# EAGLE design jtag-swd (EAGLE 5.07)
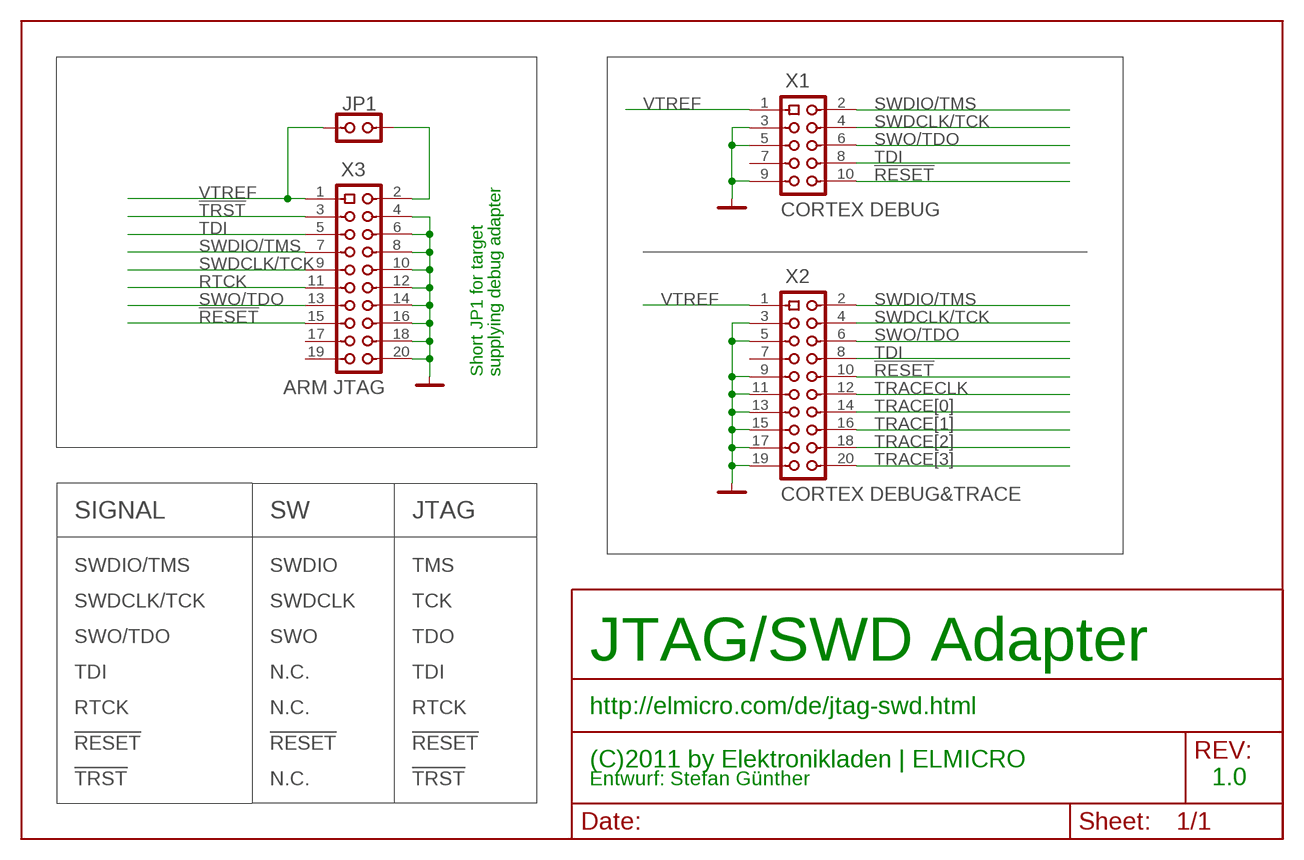
[diagram p0: schematic, sheet 1]

## Parts
JP1  JP2  [JP2]
X1  CORTEX DEBUG  PF2X5SMD1.27MM  [PF2X5SMD50MIL]
X2  CORTEX DEBUG&TRACE  PF2X101,27MMSMDPOS  [PF2X10SMD50MIL_POS]
X3  ARM JTAG  PF2X10  [PF2X10]

## Nets
!RESET: X1.10 X2.10 X3.15
!TRST: X3.3
GND: X1.3 X1.5 X1.9 X2.3 X2.5 X2.9 X2.11 X2.13 X2.15 X2.17 X2.19 X3.4 X3.6 X3.8 X3.10 X3.12 X3.14 X3.16 X3.18 X3.20
N$1: JP1.2 X3.2
RTCK: X3.11
SWDCLK/TCK: X1.4 X2.4 X3.9
SWDIO/TMS: X1.2 X2.2 X3.7
SWO/TDO: X1.6 X2.6 X3.13
TDI: X1.8 X2.8 X3.5
TRACE[0]: X2.14
TRACE[1]: X2.16
TRACE[2]: X2.18
TRACE[3]: X2.20
TRACECLK: X2.12
VTREF: JP1.1 X1.1 X2.1 X3.1
Unconnected: X1.7 X2.7 X3.17 X3.19

## Notes on the sheet
- Short JP1 for target | supplying debug adapter
- SIGNAL | SW | JTAG
- SWDIO/TMS | SWDIO | TMS
- SWDCLK/TCK | SWDCLK | TCK
- SWO/TDO | SWO | TDO
- JTAG/SWD Adapter
- TDI | N.C. | TDI
- RTCK | N.C. | RTCK | http://elmicro.com/de/jtag-swd.html
- !RESET | !RESET | !RESET
- (C)2011 by Elektronikladen | ELMICRO
- !TRST | N.C. | !TRST | Entwurf: Stefan Günther | 1.0

## Library data of the parts
JP1 = A_CONN:JP2
X1 = A_CONN:PF2X5
X2 X3 = A_CONN:PF2X10

## Board
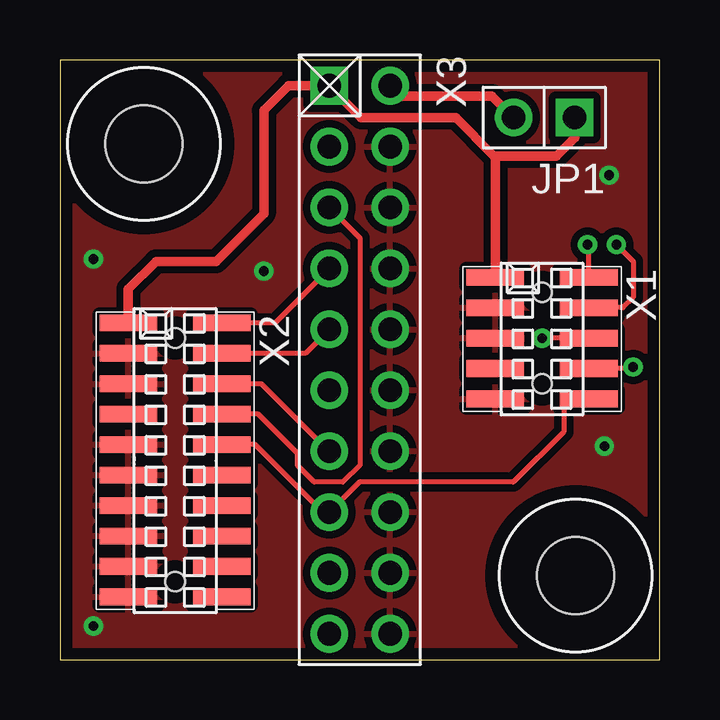
[diagram p1: board, top side]
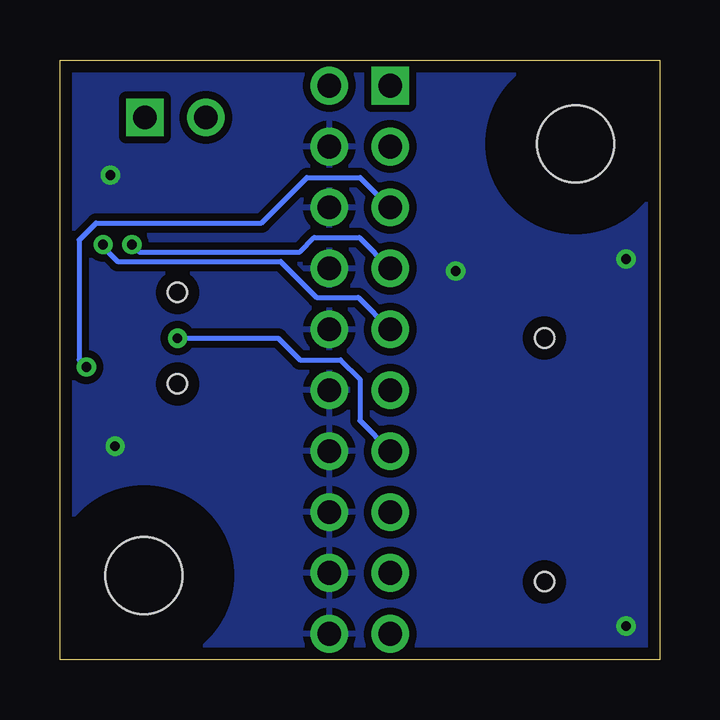
[diagram p2: board, bottom side, seen from below]

Size 25 x 25 mm. Coordinates in mm from the lower left corner, seen from the top.
Outline: 0,25 0,0 25,0 25,25 0,25
Copper layers (1*2*3*16): Top 0.035mm / dielectric 0.5mm / Route2 0.035mm / dielectric 0.26mm / Route3 0.035mm / dielectric 0.5mm / Bottom 0.035mm
Design rules "pcbpool_standard_2010-09-08": minimum track width 0.15mm, minimum drill 0.3mm, track to track 0.15mm, track to pad 0.15mm, pad to pad 0.15mm, via to via 0.15mm, smd to smd 0.15mm, copper to edge 0.5mm, drill to drill 0.5mm, minimum pad ring 0.15mm, minimum via ring 0.15mm, stop-mask expansion 0.05mm, vias tented up to drill 0.55mm, thermal gap 0.3mm

### Footprints (pad centres in the part's own frame; a part is rotated, then mirrored left to right if it is on the bottom)
JP2 = drill 0.991 pad 1.575 square: 1 0,0 | drill 0.991 pad 1.575 round: 2 2.54,0
BOHR3MM2 = hole 3.2: 0,0
PF2X5SMD50MIL = smd 0.7 x 2.4: 1 -2.54,-1.95; 2 -2.54,1.95; 3 -1.27,-1.95; 4 -1.27,1.95; 5 0,-1.95; 6 0,1.95; 7 1.27,-1.95; 8 1.27,1.95; 9 2.54,-1.95; 10 2.54,1.95 | hole 0.8: -1.905,0; 1.905,0
PF2X10SMD50MIL_POS = smd 0.7 x 2.4: 1 -2.54,-1.95; 2 -2.54,1.95; 3 -1.27,-1.95; 4 -1.27,1.95; 5 0,-1.95; 6 0,1.95; 7 1.27,-1.95; 8 1.27,1.95; 9 2.54,-1.95; 10 2.54,1.95; 11 3.81,-1.95; 12 3.81,1.95; 13 5.08,-1.95; 14 5.08,1.95; 15 6.35,-1.95; 16 6.35,1.95; 17 7.62,-1.95; 18 7.62,1.95; 19 8.89,-1.95; 20 8.89,1.95 | hole 0.8: -1.905,0; 8.255,0
PF2X10 = drill 0.991 pad 1.575 square: 1 0,0 | drill 0.991 pad 1.575 round: 2 0,2.54; 3 2.54,0; 4 2.54,2.54; 5 5.08,0; 6 5.08,2.54; 7 7.62,0; 8 7.62,2.54; 9 10.16,0; 10 10.16,2.54; 11 12.7,0; 12 12.7,2.54; 13 15.24,0; 14 15.24,2.54; 15 17.78,0; 16 17.78,2.54; 17 20.32,0; 18 20.32,2.54; 19 22.86,0; 20 22.86,2.54

### Placement (x,y rotation side)
JP1  21.46,22.6 180 top
U$5  [BOHR3MM2]  3.5,21.5 0 top
U$6  [BOHR3MM2]  21.5,3.5 0 top
X1  20.1,13.4 270 top
X2  4.8,11.5 270 top
X3  11.23,23.93 270 top

### Tracks (layer width: path | path; a pad name or v marks a point on that pad's centre or on a via)
!RESET
  Top 0.2: X1.10 21.89,10.7 21,10.7 21,9.5 18.9,7.4 12.48,7.4 X3.15 11.18,6.2 11.1,6.2 10.9,6.2 8.14,8.96 X2.10
GND  (via drill 0.4 pad 0.8)
  other vias: 22.9,20.2 22.7,8.9 1.4,1.4 8.5,16.2 1.4,16.7
  pour Top (isolate 0.305): 0,25 25,25 25,0 0,0
  pour Bottom (isolate 0.305): 0,25 25,25 25,0 0,0
N$1
  Top 0.4: X3.2 14.2,23.5 18.02,23.5 JP1.2
SWDCLK/TCK  (via drill 0.4 pad 0.8)
  Top 0.2: X2.4 10.23,12.77 X3.9 | X1.4 23.47,14.67 23.9,15.1 23.9,16.6 v23.2,17.3
  Bottom 0.2: v23.2,17.3 23.2,17.2 22.6,16.6 15.8,16.6 14.3,15.1 12.56,15.1 X3.9
SWDIO/TMS  (via drill 0.4 pad 0.8)
  Top 0.2: X2.2 8.96,14.04 X3.7 | X1.2 22.05,17.25 v22,17.3
  Bottom 0.2: v22,17.3 21.7,17 15,17 14.4,17.6 12.52,17.6 X3.7
SWO/TDO  (via drill 0.4 pad 0.8)
  Top 0.2: X1.6 v20.1,13.4 | X2.6 8.4,11.5 11.2,8.7 X3.13
  Bottom 0.2: v20.1,13.4 15.9,13.4 15,12.5 13.3,12.5 12.5,11.7 12.5,9.96 X3.13
TDI  (via drill 0.4 pad 0.8)
  Top 0.2: X3.5 12.5,17.58 12.5,8.1 11.8,7.4 10.6,7.4 9.9,8.1 9.9,8.6 8.27,10.23 X2.8 | X1.8 23.83,12.13 v23.9,12.2
  Bottom 0.2: v23.9,12.2 24.2,12.5 24.2,17.5 23.5,18.2 16.6,18.2 14.7,20.1 12.48,20.1 X3.5
VTREF
  Top 0.4: JP1.1 21.46,21.76 20.7,21 18.1,21 | 18.1,21 16.5,22.6 12.56,22.6 X3.1 9.53,23.93 8.5,22.9 8.5,18.6 6.5,16.6 4,16.6 2.85,15.45 X2.1 | X1.1 18.15,20.95 18.1,21